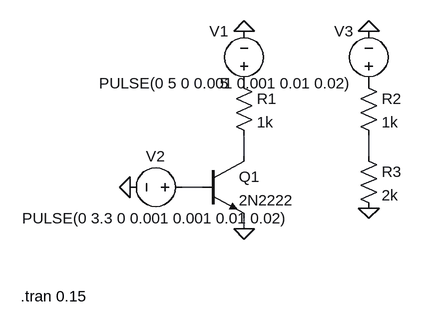
[diagram p0: schematic level convertor.asc]
level convertor.asc, the LTspice schematic file:
Version 4
SHEET 1 880 680
WIRE 144 96 144 64
WIRE 336 96 336 64
WIRE 80 144 48 144
WIRE 144 208 144 192
FLAG 144 -96 0
FLAG -32 144 0
FLAG 144 208 0
FLAG 336 -96 0
FLAG 336 176 0
SYMBOL npn 80 96 R0
SYMATTR InstName Q1
SYMATTR Value 2N2222
SYMBOL voltage 144 0 R180
WINDOW 0 24 96 Left 2
WINDOW 3 24 16 Left 2
WINDOW 123 0 0 Left 0
WINDOW 39 0 0 Left 0
SYMATTR InstName V1
SYMATTR Value 5
SYMBOL voltage 64 144 R90
WINDOW 0 -32 56 VBottom 2
WINDOW 3 32 56 VTop 2
WINDOW 123 0 0 Left 0
WINDOW 39 0 0 Left 0
SYMATTR InstName V2
SYMATTR Value PULSE(0 3.3 0 0.001 0.001 0.01 0.02)
SYMBOL res 128 -32 R0
SYMATTR InstName R1
SYMATTR Value 1k
SYMBOL res 320 -32 R0
SYMATTR InstName R2
SYMATTR Value 1k
SYMBOL res 320 80 R0
SYMATTR InstName R3
SYMATTR Value 2k
SYMBOL voltage 336 0 R180
WINDOW 0 24 96 Left 2
WINDOW 3 24 16 Left 2
WINDOW 123 0 0 Left 0
WINDOW 39 0 0 Left 0
SYMATTR InstName V3
SYMATTR Value PULSE(0 5 0 0.001 0.001 0.01 0.02)
TEXT -200 312 Left 2 !.tran 0.15

The netlist it stands for:
* level convertor.asc
Q1 N001 N003 0 0 2N2222
V1 P001 0 5
V2 N003 0 PULSE(0 3.3 0 0.001 0.001 0.01 0.02)
R1 P001 N001 1k
R2 P002 N002 1k
R3 N002 0 2k
V3 P002 0 PULSE(0 5 0 0.001 0.001 0.01 0.02)
.model NPN NPN
.model PNP PNP
.lib standard.bjt
.tran 0.15
.backanno
.end